# Altium schematic sheet MAXREFDES117_APPS_P1.SchDoc
size 424 x 274 mm
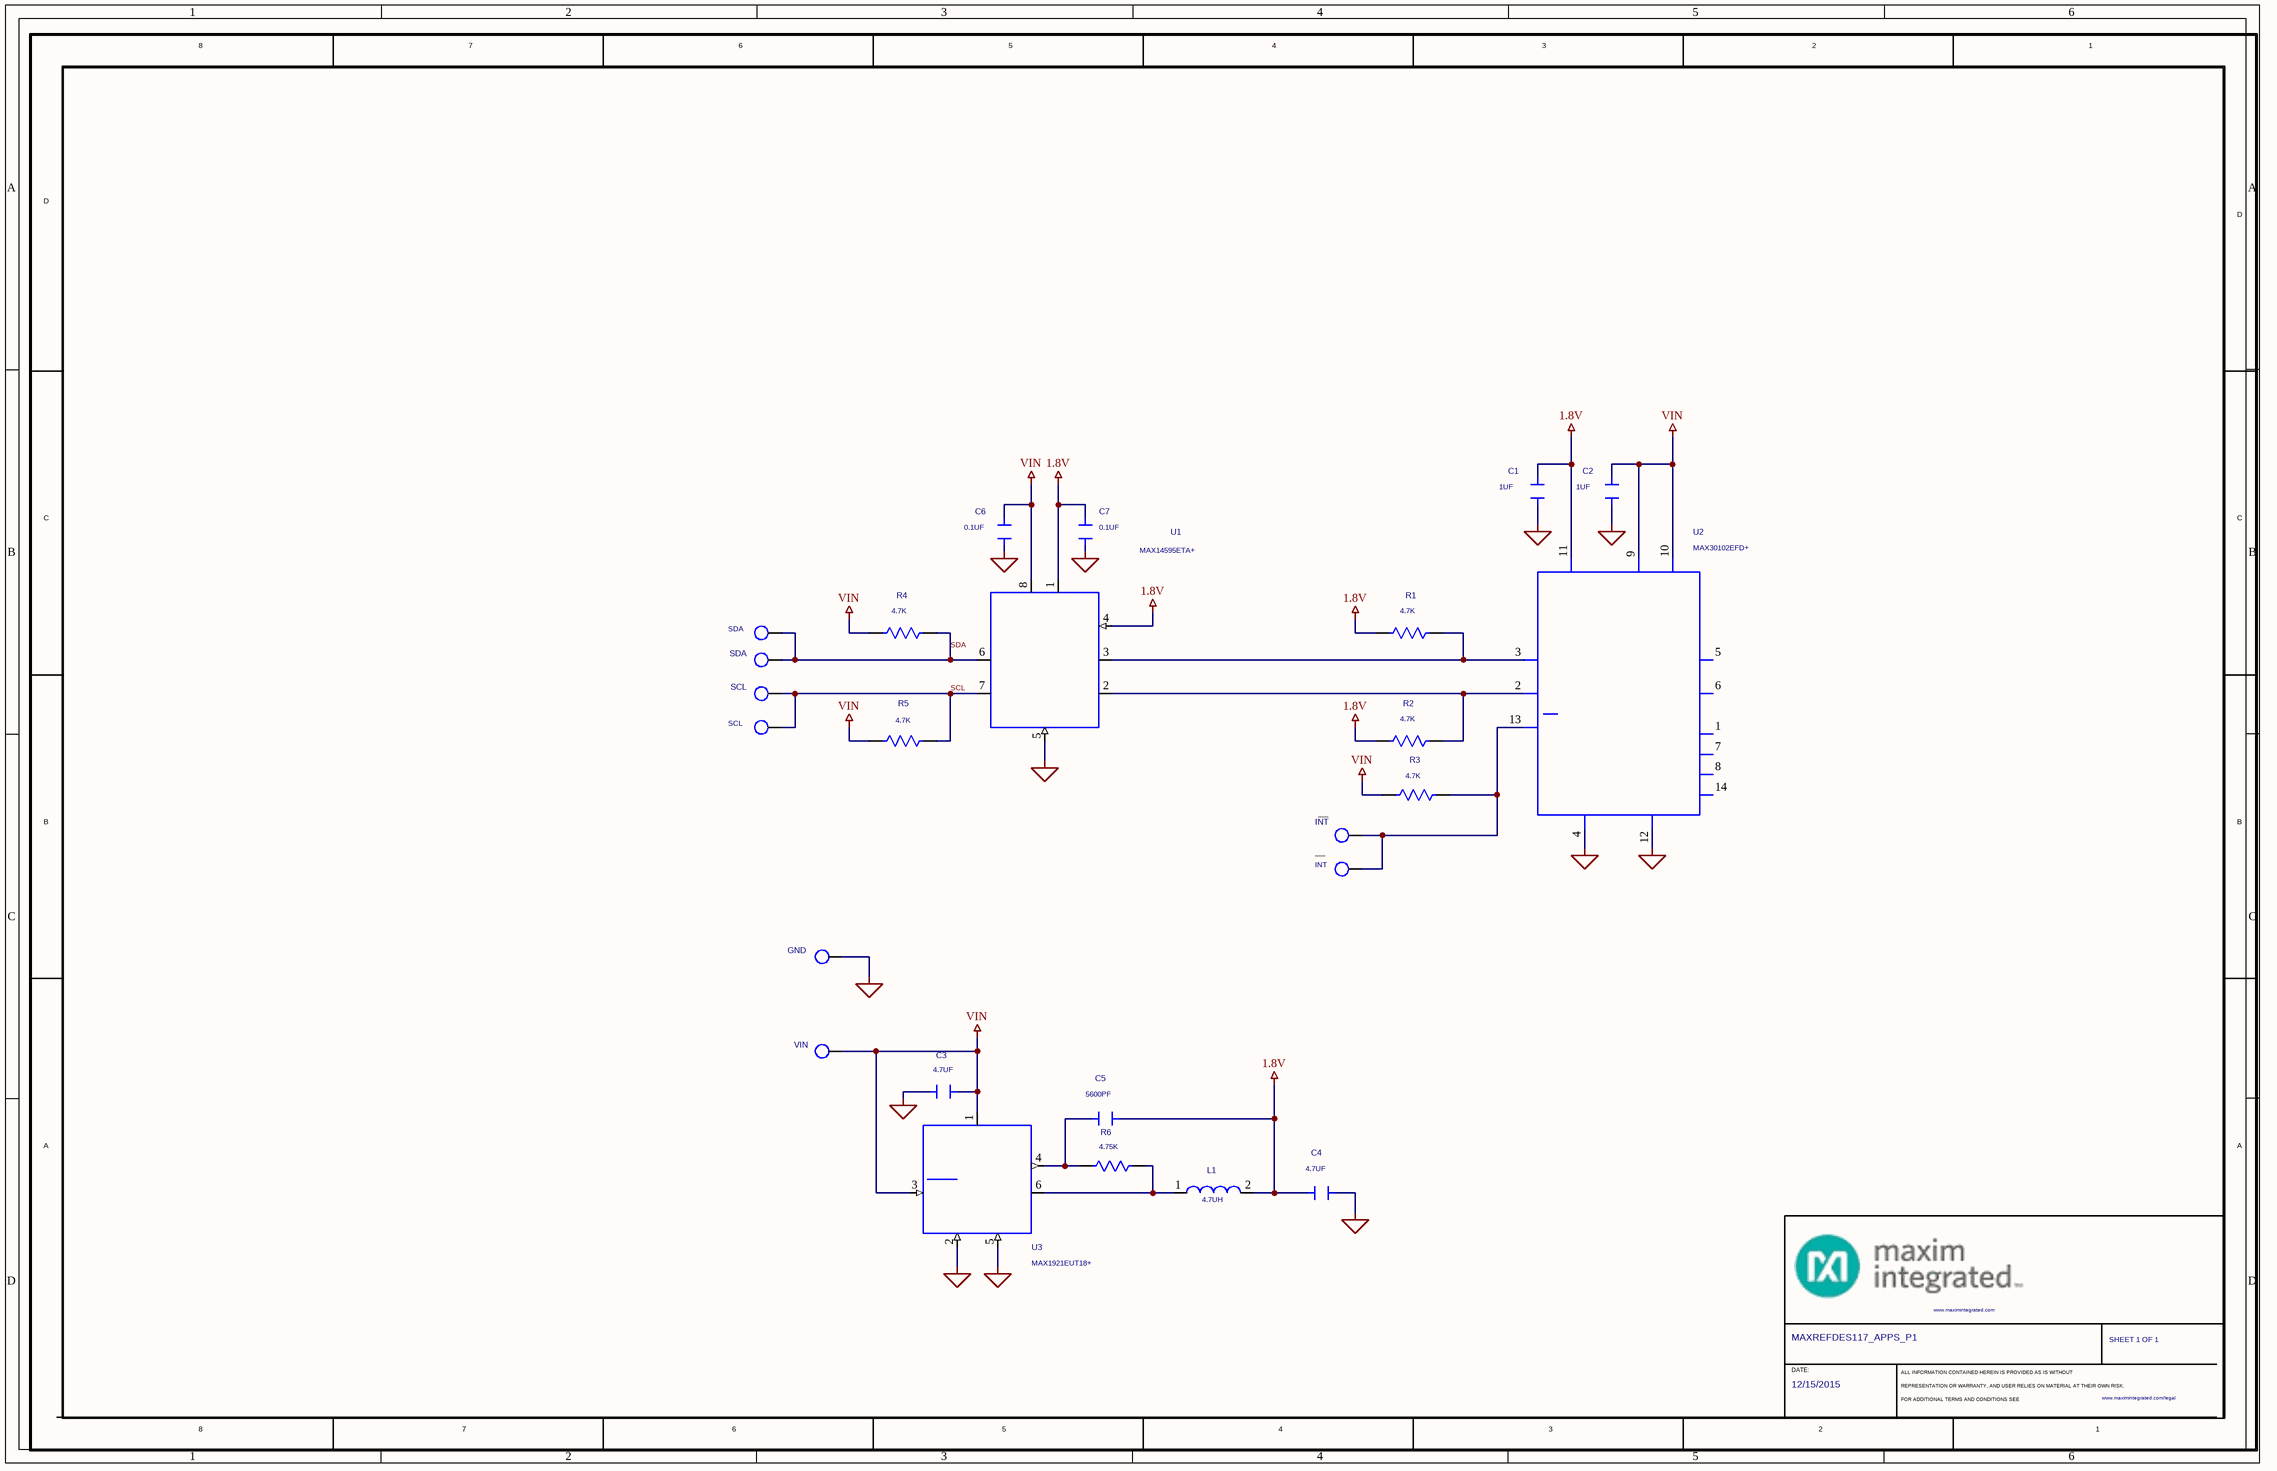
[diagram p0: MAXREFDES117_APPS_P1.SchDoc]

## Parts
*  CUSTOM_TXT_CDS21: SHEET 1 OF 1  PROJECT_TITLE: MAXREFDES117_APPS_P1  DATE: 12/15/2015  (hidden comment: MAXIM_B_SIZE_CF)  (graphical)
C1  1UF  [0402]
C2  1UF  [0402]
C3  4.7UF  [0402]
C4  4.7UF  [0402]
C5  5600PF  [0402]
C6  0.1UF  [0402]
C7  0.1UF  [0402]
GND  N/A  [EK_TP_PEDGE]  (value not drawn)
INT  N/A  [EK_TP_PEDGE]  (value not drawn)
L1  4.7UH  [0603]
R1  4.7K  [0402]
R2  4.7K  [0402]
R3  4.7K  [0402]
R4  4.7K  [0402]
R5  4.7K  [0402]
R6  4.75K  [0402]
SCL  N/A  [EK_TP_PEDGE]  (value not drawn)
SDA  N/A  [EK_TP_PEDGE]  (value not drawn)
U1  MAX14595ETA+  [MAXIM_90-0349]
U2  MAX30102EFD+  [PSON80P560X330X165-14M]
U3  MAX1921EUT18+  [SOT95P280X145-6M]
VIN  N/A  [EK_TP_PEDGE]  (value not drawn)
X1  COMMENTS: SDA  [EK_TP_PEDGE]  (hidden comment: N/A)
X2  COMMENTS: SCL  [EK_TP_PEDGE]  (hidden comment: N/A)
X3  COMMENTS: INT  [EK_TP_PEDGE]  (hidden comment: N/A)

## Nets
1.8V: C1.2 C4.1 C5.2 C7.2 L1.2 R1.1 R2.1 U1.1(VL) U1.4(/TS) U2.11(VDD)
GND_SIGNAL: C1.1 C2.1 C3.1 C4.2 C6.1 C7.1 GND.1(TP1) U1.5(GND) U2.4(PGND) U2.12(GND) U3.2(AGND) U3.5(PGND)
VIN: C2.2 C3.2 C6.2 R3.1 R4.1 R5.1 U1.8(VCC) U2.9(VLED+_1) U2.10(VLED+_2) U3.1(IN) U3.3(/SHDN) VIN.1(TP1)
SCL: R5.2 SCL.1(TP1) U1.7(IOVCC2) X2.1(TP1)
SDA: R4.2 SDA.1(TP1) U1.6(IOVCC1) X1.1(TP1)
NetC5_1: C5.1 R6.1 U3.4(OUT)
NetINT_1: INT.1(TP1) R3.2 U2.13(/INT) X3.1(TP1)
NetL1_1: L1.1 R6.2 U3.6(LX)
NetR1_2: R1.2 U1.3(IOVL1) U2.3(SDA)
NetR2_2: R2.2 U1.2(IOVL2) U2.2(SCL)

Not connected (* = marked no-connect by the designer): U2 1(NC_1) 5(R_DRV) 6(IR_DRV) 7(NC_2) 8(NC_3) 14(NC_4)

## Notes on the sheet
- (near INT) –––
- –––
- (in symbol MAXIM_B_SIZE_CF) 8; 7; 6; 5; 4; 3; 2; D; C; B; A; DATE:; ALL INFORMATION CONTAINED HEREIN IS PROVIDED AS IS WITHOUT; REPRESENTATION OR WARRANTY, AND USER RELIES ON MATERIAL AT THEIR OWN RISK.; FOR ADDITIONAL TERMS AND CONDITIONS SEE

## Library data of the parts
* = MAXIM_B_SIZE_CF: OriginalSymbolOrigin: (175,5230); COMMENT_BODY: TRUE; Page Number: 1; LEAGAL_WEBLINK: www.maximintegrated.com/legal; WEBLINK1: www.maximintegrated.com
C1 C2 = CAP_NP#1: CAP; SMT (0402); 1UF; 10%; 10V; X5R; CERAMIC; MANUFACTURER: VENKEL LTD.;MURATA; OriginalSymbolOrigin: (-50,50); PACK_TYPE: 0402CAP; MAXINV: 20-0001U-33; CAP: 1.00E-06; DRAWING: @MAXREFDES117_APPS_P1.MAXREFDES117_APPS_P1(SCH_1):PAGE2; PHYS_PAGE: 1; VER: 2; TEMP_RANGE: -55 DEGC TO +85 DEGC; VLOG_PARAM01: CAP:INTEGER; TOLERANCE: 10%; VOLTAGE_RATING: 10V
C3 C4 = CAP_NP: CAP; SMT (0402); 4.7UF; 20%; 4V; X5R; CERAMIC; MANUFACTURER: KEMET;MURATA;MURATA; OriginalSymbolOrigin: (-50,50); PACK_TYPE: 0402CAP; MAXINV: 20-004U7-B65; CAP: 4.70E-06; DRAWING: @MAXREFDES117_APPS_P1.MAXREFDES117_APPS_P1(SCH_1):PAGE2; PHYS_PAGE: 1; TEMP_RANGE: -55 DEGC TO +85 DEGC; VLOG_PARAM01: CAP:INTEGER; TOLERANCE: 20%; VER: 1; VOLTAGE_RATING: 4V
C5 = CAP_NP: CAP; SMT (0402); 5600PF; 10%; 25V; X7R; CERAMIC; MANUFACTURER: VENKEL LTD;MURATA;MURATA; OriginalSymbolOrigin: (-50,50); PACK_TYPE: 0402CAP; MAXINV: 20-5600P-12; CAP: 5.60E-09; DRAWING: @MAXREFDES117_APPS_P1.MAXREFDES117_APPS_P1(SCH_1):PAGE2; PHYS_PAGE: 1; TEMP_RANGE: -55 DEGC TO +125 DEGC; VLOG_PARAM01: CAP:INTEGER; TOLERANCE: 10%; VER: 1; VOLTAGE_RATING: 25V
C6 C7 = CAP_NP#1: CAP; SMT (0402); 0.1UF; 10%; 16V; X7R; CERAMIC; MANUFACTURER: TDK;AMERICAN TECHNICAL CERAMICS;AVK;VENKEL LTD.;SAMSUNG ELECTRONICS;MURATA;TDK;YAGEO PHICOMP;TAIYO YUDEN;SAMSUNG ELECTRONICS; OriginalSymbolOrigin: (-50,50); PACK_TYPE: 0402CAP; MAXINV: 20-000U1-L1A; CAP: 1.00E-07; DRAWING: @MAXREFDES117_APPS_P1.MAXREFDES117_APPS_P1(SCH_1):PAGE2; PHYS_PAGE: 1; VER: 2; TEMP_RANGE: -55 DEGC TO +125 DEGC; VLOG_PARAM01: CAP:INTEGER; TOLERANCE: 10%; VOLTAGE_RATING: 16V
GND INT SCL SDA VIN X1-X3 = EVKIT_TP: TEST POINT; PAD DIMENSION =2.00MM X 2.00MM X ROUND BASE DIA=1.00 MM; BOARD HOLE= 1.02MM; OriginalSymbolOrigin: (-125,50); DRAWING: @MAXREFDES117_APPS_P1.MAXREFDES117_APPS_P1(SCH_1):PAGE2; PHYS_PAGE: 1; PACK_TYPE: EVKIT_TP; MAXINV: N/A; TOLERANCE: N/A; VER: 1; VOLTAGE_RATING: N/A; TEMP_RANGE: N/A
L1 = INDUCT: INDUCTOR; SMT (0603); MAGNETICALLY SHIELDED; 4.7UH; TOL=+/-20%; 0.5A; MANUFACTURER: TDK; OriginalSymbolOrigin: (-100,50); MAXINV: 50-004U7-0HR; DRAWING: @MAXREFDES117_APPS_P1.MAXREFDES117_APPS_P1(SCH_1):PAGE2; PHYS_PAGE: 1; TOLERANCE: 20%; TEMP_RANGE: -40 DEGC TO +105 DEGC; PACK_TYPE: 0603; VER: 1
R1-R5 = RES_SMD: RES; SMT (0402); 4.7K; 1%; +/-100PPM/DEGC; 0.1000W; MANUFACTURER: PANASONIC; OriginalSymbolOrigin: (-75,50); PACK_TYPE: 0402RES; MAXINV: 80-004K7-18; DRAWING: @MAXREFDES117_APPS_P1.MAXREFDES117_APPS_P1(SCH_1):PAGE2; PHYS_PAGE: 1; POWER_RATING: 0.10W; RES: 4.70E03; VER: 2; TEMP_RANGE: -55 DEGC TO +155 DEGC; VLOG_PARAM01: RES:INTEGER; TOLERANCE: 1%
R6 = RES_SMD: RES; SMT (0402); 4.75K; 1%; +/-100PPM/DEGC; 0.0630W; MANUFACTURER: VISHAY DALE; OriginalSymbolOrigin: (-75,50); PACK_TYPE: 0402RES; MAXINV: 80-04K75-23; DRAWING: @MAXREFDES117_APPS_P1.MAXREFDES117_APPS_P1(SCH_1):PAGE2; PHYS_PAGE: 1; POWER_RATING: 0.0625W; RES: 4.75E03; VER: 2; TEMP_RANGE: -55 DEGC TO +155 DEGC; VLOG_PARAM01: RES:INTEGER; TOLERANCE: 1%
U1 = MAX14595: IC; TRANS; LOW-POWER DUAL-CHANNEL LOGIC-LEVEL TRANSLATOR; TDFN8 2X2; MANUFACTURER: MAXIM; OriginalSymbolOrigin: (-200,250); MAXINV: 10-MAX14595ETA-T; DRAWING: @MAXREFDES117_APPS_P1.MAXREFDES117_APPS_P1(SCH_1):PAGE2; PHYS_PAGE: 1; VOLTAGE_RATING: +1.65V TO +5.5V; TEMP_RANGE: -40 DEGC TO +85 DEGC; PACK_TYPE: TDFN8; CASE: TDFN8; CLASSIFICATION: TRANSLATOR; MFG_PART_NUMBER: MAX14595ETA+; REFLOW: -; TOLERANCE: N/A; VER: 1
U2 = MAX30102: MODULE; SNSR; HIGH-SENSITIVITY PULSE OXIMETER AND HEART-RATE SENSOR FOR WEARABLE; SMT 5.6MM X 3.3MM; MANUFACTURER: MAXIM; OriginalSymbolOrigin: (-350,525); PACK_TYPE: OLGA14; MAXINV: 10-MAX30102EFD-00; DRAWING: @MAXREFDES117_APPS_P1.MAXREFDES117_APPS_P1(SCH_1):PAGE2; PHYS_PAGE: 1; VER: 3; VOLTAGE_RATING: +1.8V AND +5V; TEMP_RANGE: -40 DEGC TO +85 DEGC; SEC_TYPE: OLGA14; TOLERANCE: N/A
U3 = MAX1921: IC; CONV; LOW-VOLTAGE; 400MA STEP-DOWN DC-DC CONVERTER; SOT23-6; MANUFACTURER: MAXIM; OriginalSymbolOrigin: (-200,200); MAXINV: 10-MAX1921EUT18-U; DRAWING: @MAXREFDES117_APPS_P1.MAXREFDES117_APPS_P1(SCH_1):PAGE2; PHYS_PAGE: 1; VOLTAGE_RATING: +1.8V; TEMP_RANGE: -40 DEGC TO +85 DEGC; PACK_TYPE: SOT23-6; TOLERANCE: N/A; VER: 1